# EasyEDA Pro project 显示30000字版电池内阻仪.eprj, board PCB2
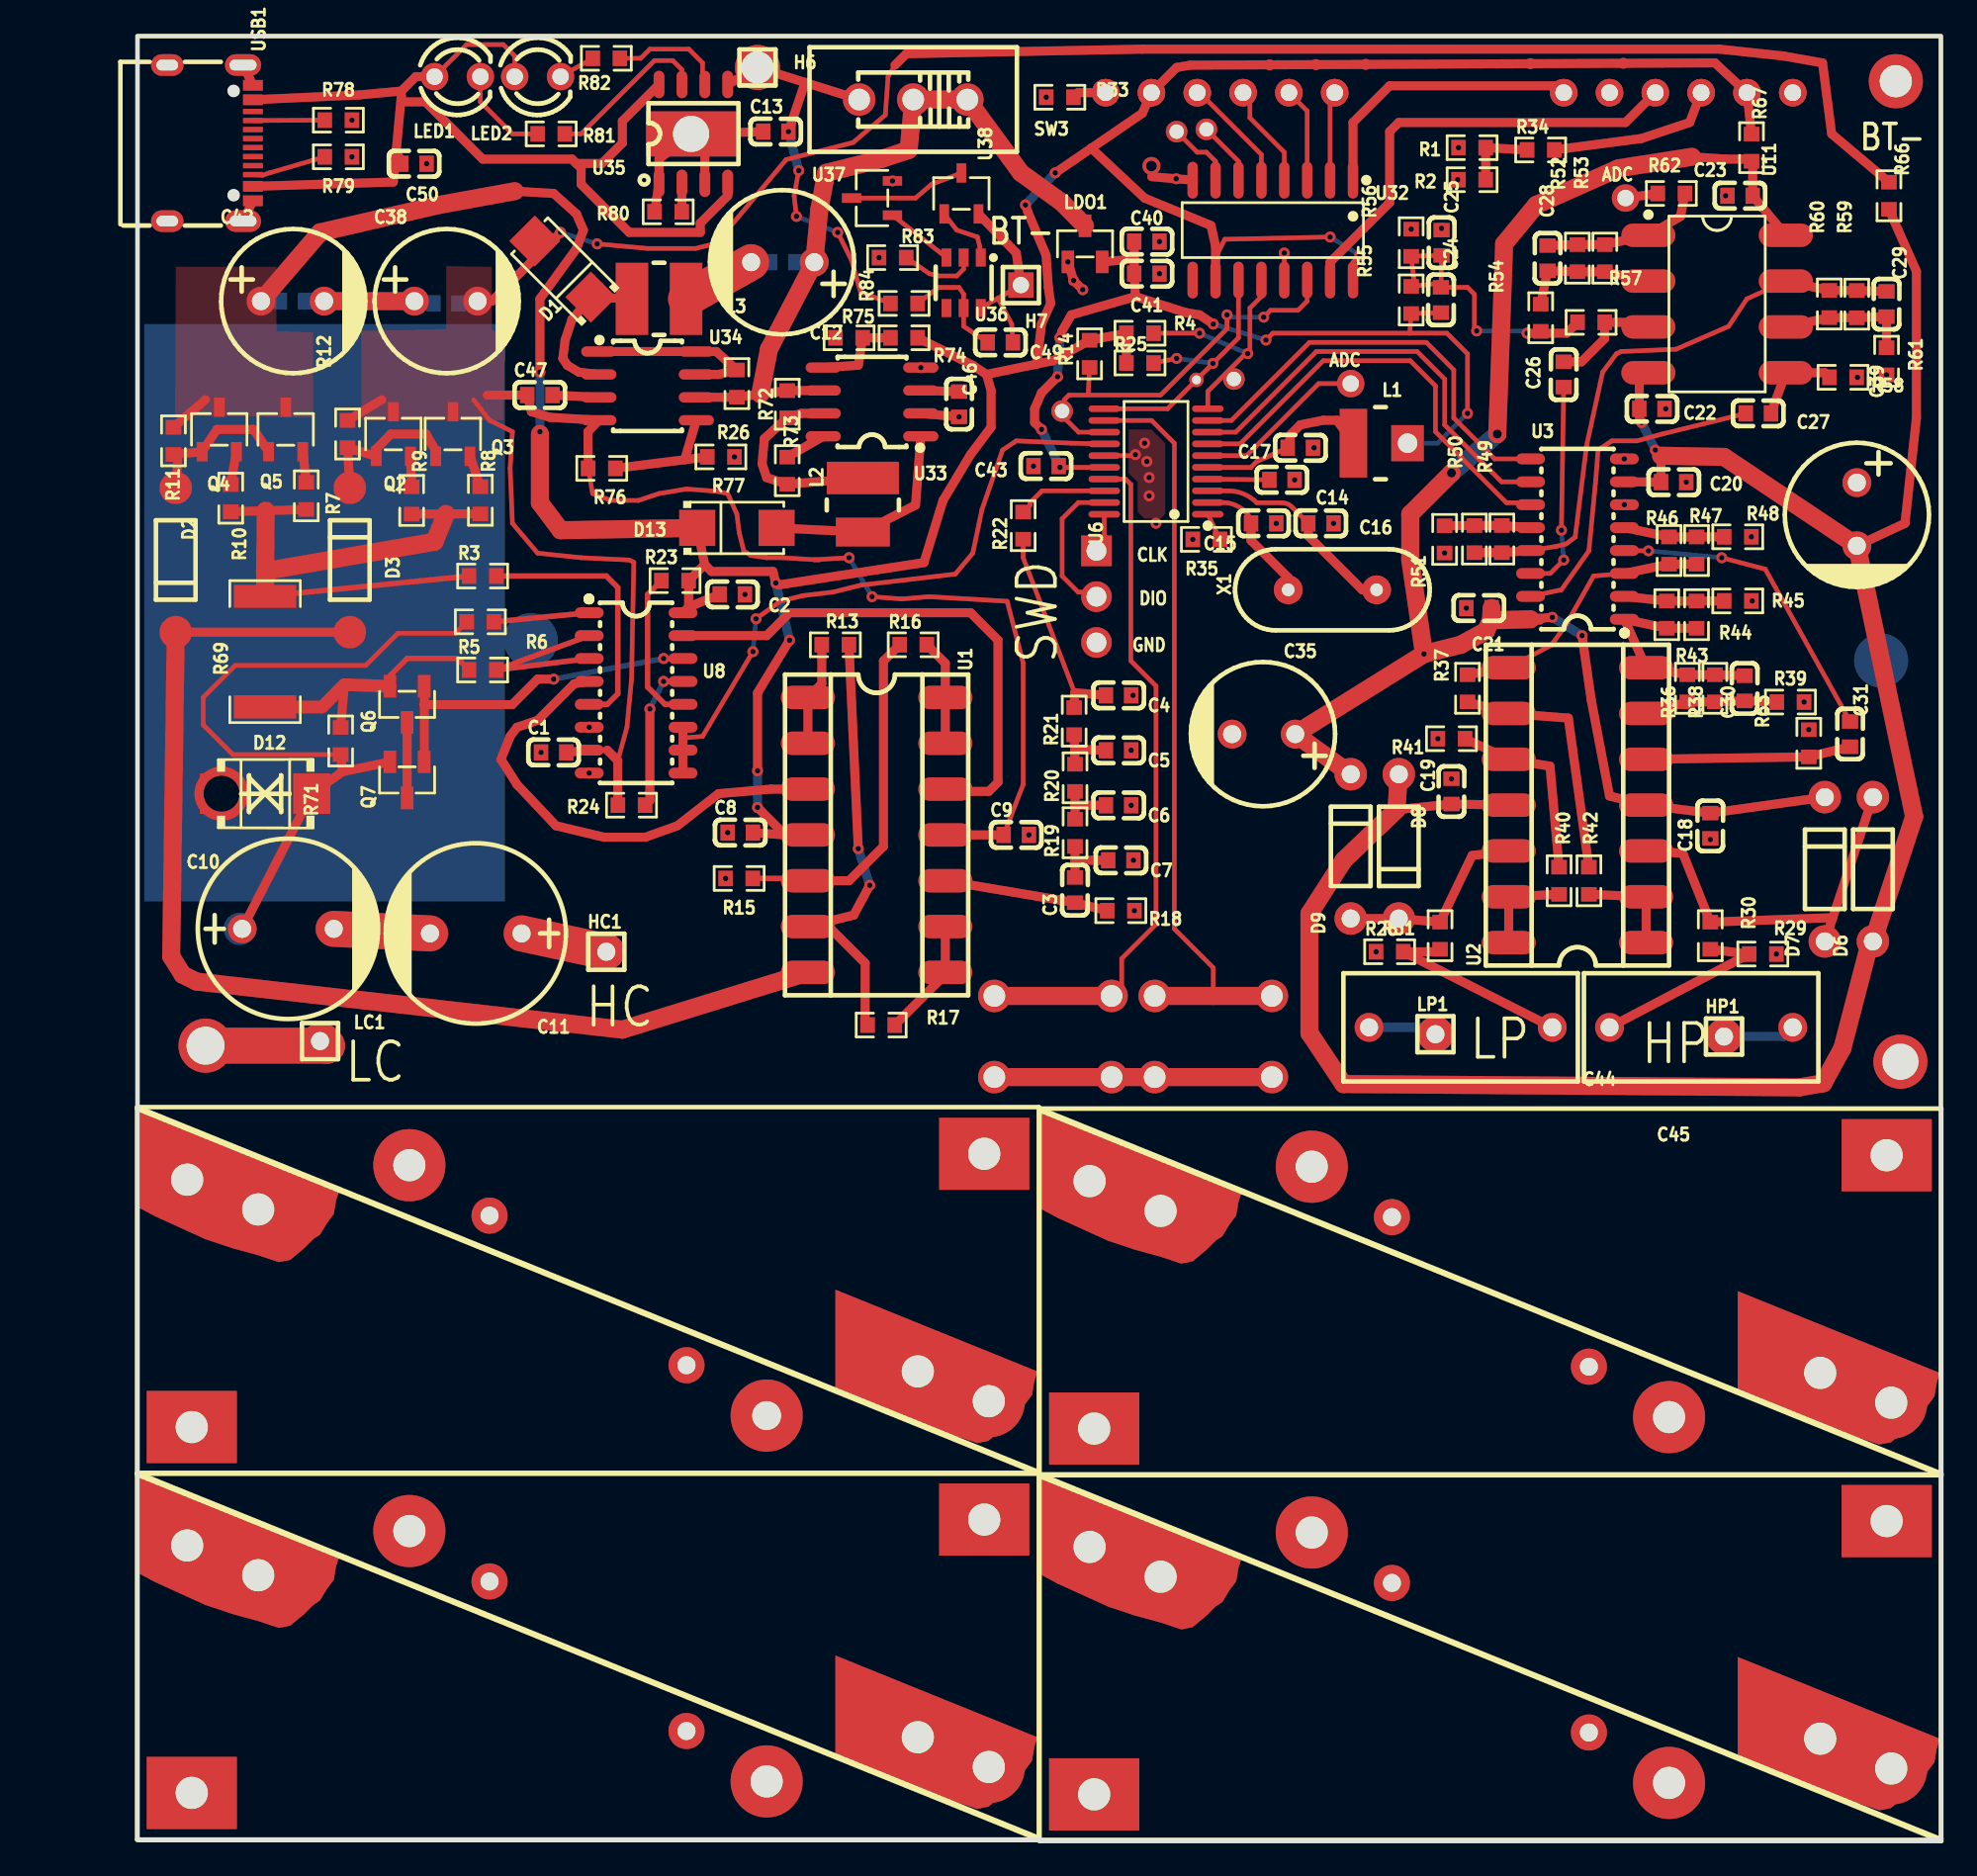
[diagram p1: board, top side]
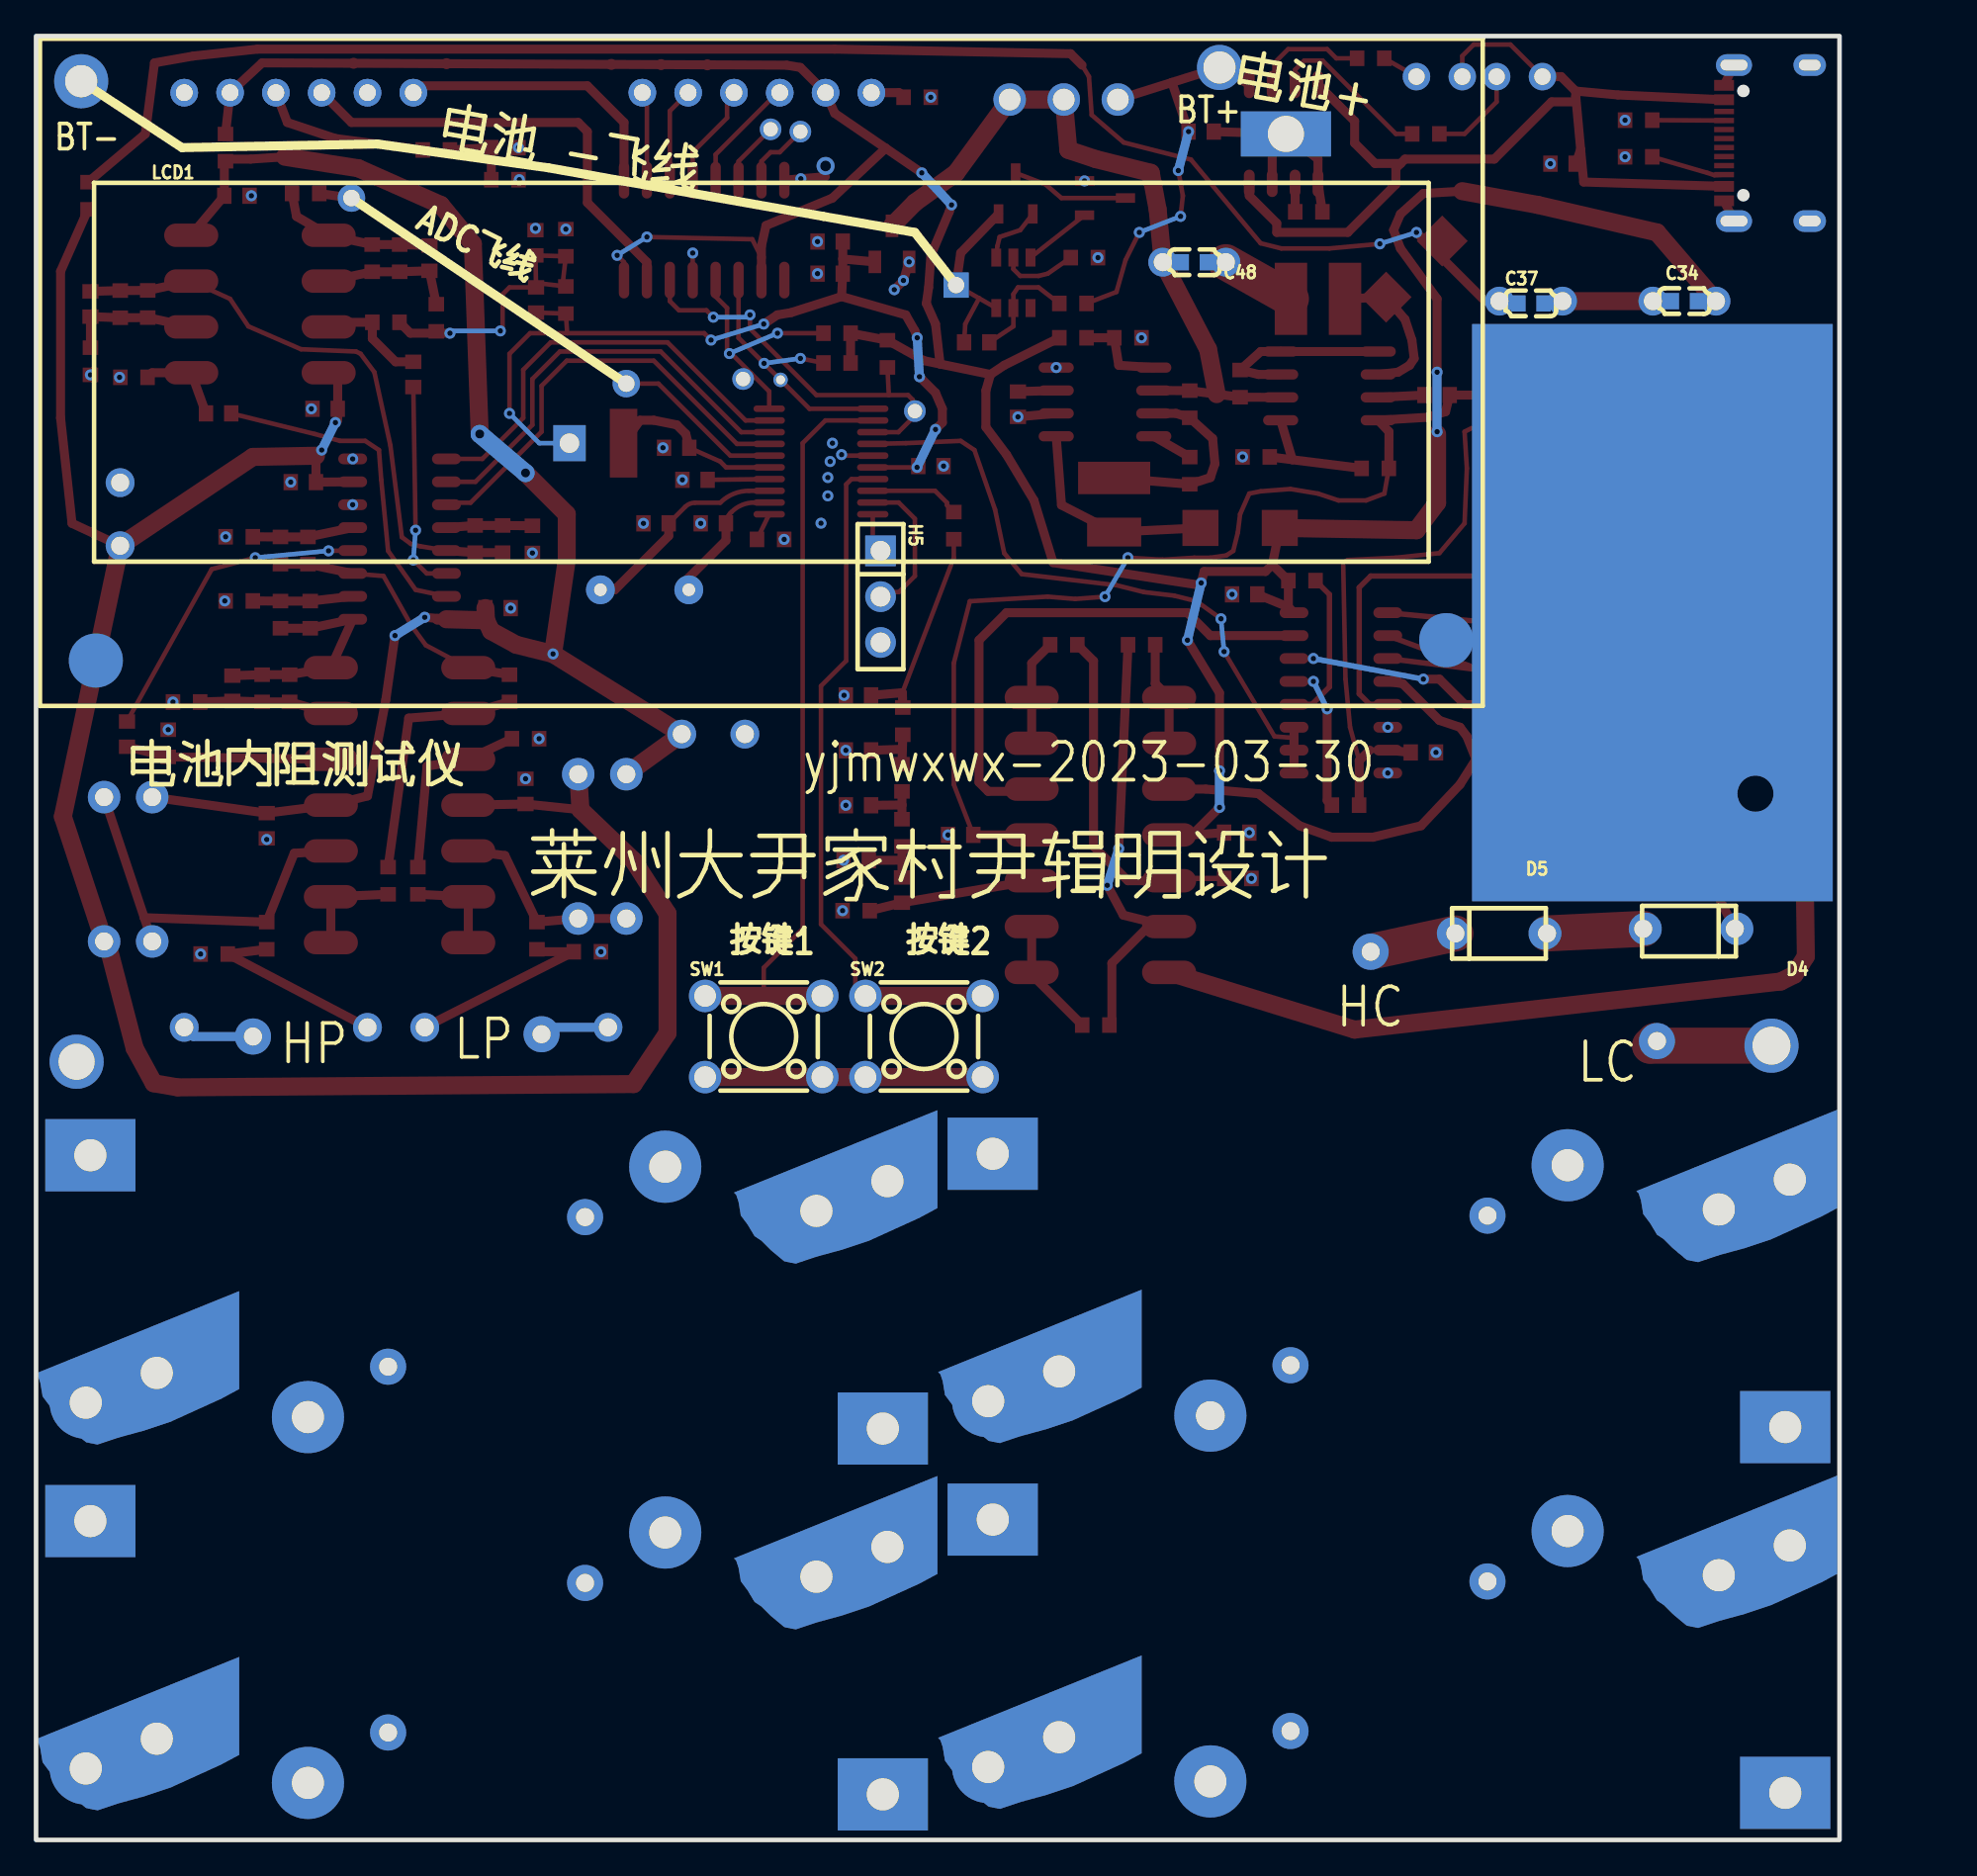
[diagram p2: board, bottom side, seen from below]

Outline 100 x 100 mm; copper layers: Top Layer, Bottom Layer. Coordinates in mm from the lower left corner of the outline.
Outline path: rectangle 0,100 100,0
Stack: Top Layer 0.035mm / Dielectric1 1.51mm FR4 er 4.5 / Bottom Layer 0.035mm

## Design rules (mm)
spacing safeClearance (default): track to track 0.152, other pairs 0.152 to 0.3
track width trackWidth (default): min 0.127, default 0.254, max 2.54
differential pair differentialPair (default): width min 0.127, default 0.254, max 2.54; gap min 0.152, default 0.152
via viaSize (default): diameter min 0.5, default 0.61, max 10; hole min 0.3, default 0.305, max 6

## Placement (name value [footprint] x y rotation side)
C1  100nF  [C0603]  23.08 60.29 0 top
C2  100nF  [C0603]  32.98 69.05 180 top
C3  10uF  [C0603]  51.99 52.66 90 top
C4  1nF  [C0603]  54.4 63.45 180 top
C5  1nF  [C0603]  54.4 60.41 180 top
C6  1nF  [C0603]  54.4 57.36 180 top
C7  100pF  [C0603]  54.53 54.31 180 top
C8  100nF  [C0603]  33.43 55.84 0 top
C9  100nF  [C0603]  48.73 55.72 0 top
C10  47uF  [CAP-TH_BD10.0-P5.00-D1.0-FD]  8.34 50.51 0 top
C11  47uF  [CAP-TH_BD10.0-P5.00-D1.0-FD]  18.76 50.25 180 top
C12  470uF  [CAP-TH_BD8.0-P3.50-D0.6-FD]  35.78 87.47 180 top
C13  10uF  [C0603]  35.4 94.7 0 top
C14  100nF  [C0603]  63.46 75.4 0 top
C15  20pF  [C0603]  62.45 72.99 0 top
C16  20pF  [C0603]  65.62 72.99 0 top
C17  10uF  [C0603]  64.48 77.18 180 top
C18  10uF  [C0603]  87.21 56.22 90 top
C19  10uF  [C0603]  72.86 58.13 90 top
C20  10uF  [C0603]  85.18 75.27 180 top
C21  10uF  [C0603]  74.38 68.29 0 top
C22  10uF  [C0603]  83.97 79.34 180 top
C23  10uF  [C0603]  88.86 91.15 0 top
C24  10uF  [C0603]  72.28 85.37 270 top
C25  10uF  [C0603]  72.31 88.54 270 top
C26  100nF  [C0603]  79.08 81.24 90 top
C27  100nF  [C0603]  89.88 79.08 0 top
C28  1nF  [C0603]  78.19 87.69 90 top
C29  1nF  [C0603]  96.98 85.15 90 top
C30  1nF  [C0603]  89.12 63.84 90 top
C31  100nF  [C0603]  94.96 61.3 270 top
C34  100nF  [C0603]  8.6 85.31 180 bottom
C35  470uF  [CAP-TH_BD8.0-P3.50-D0.6-FD]  62.45 61.3 180 top
C37  100nF  [C0603]  17.11 85.18 180 bottom
C38  470uF  [CAP-TH_BD8.0-P3.50-D0.6-FD]  17.11 85.31 0 top
C39  470uF  [CAP-TH_BD8.0-P3.50-D0.6-FD]  95.34 73.5 270 top
C40  100nF  [C0603]  55.97 88.61 180 top
C41  10uF  [C0603]  55.97 86.83 180 top
C42  470uF  [CAP-TH_BD8.0-P3.50-D0.6-FD]  8.6 85.31 0 top
C43  10uF  [C0603]  50.38 76.16 0 top
C44  100nF  [CAP-TH_L13.0-W6.0-P10.00-D1.0]  73.37 45.05 180 top
C45  100nF  [CAP-TH_L13.0-W6.0-P10.00-D1.0]  86.7 45.05 0 top
C46  1nF  [C0603]  45.56 79.59 270 top
C47  1nF  [C0603]  22.31 80.1 0 top
C48  100nF  [C0603]  35.78 87.47 0 bottom
C49  100nF  [C0603]  47.84 83.02 180 top
C50  10uF  [C0603]  15.33 92.93 180 top
D1  SS34  [SMA_L4.3-W2.6-LS5.2-RD]  23.58 87.08 135 top
D2  1N4148  [DO-35_BD2.0-L4.0-P8.00-D0.5-FD]  2.12 70.95 270 top
D3  1N4148  [DO-35_BD2.0-L4.0-P8.00-D0.5-FD]  11.77 70.95 90 top
D4  -  [DO_1N4007]  8.34 50.38 0 bottom
D5  -  [DO_1N4007#2]  18.89 50.25 180 bottom
D6  1N4148  [DO-35_BD2.0-L4.0-P8.00-D0.5-FD#2]  96.23 53.81 90 top
D7  1N4148  [DO-35_BD2.0-L4.0-P8.00-D0.5-FD#2]  93.56 53.81 90 top
D8  1N4148  [DO-35_BD2.0-L4.0-P8.00-D0.5-FD#2]  69.94 55.08 270 top
D9  1N4148  [DO-35_BD2.0-L4.0-P8.00-D0.5-FD#2]  67.27 55.08 90 top
D12  1.0SMBJ5.0CA  [SMB_L4.6-W3.6-LS5.3-BI]  7.07 58 0 top
D13  SS34  [SMA_L4.3-W2.6-LS5.2-RD]  33.24 72.73 0 top
H5  -  [HDR-TH_3P-P2.54-V-M]  53.18 68.92 270 bottom
H6  -  [HDR-TH_1P-V-M_XKB_X4611WV-01I-C28D40]  34.38 98.26 0 top
H7  -  [HDR-TH_1P-V-M_XKB_X4611WV-01I-C28D40#2]  48.98 86.19 0 top
HC1  -  [HDR-TH_1P-V-M_XKB_X4611WV-01I-C28D40#3]  26 49.24 0 top
HP1  -  [HDR-TH_1P-V-M_XKB_X4611WV-01I-C28D40#3]  87.97 44.54 0 top
L1  47uH  [IND-SMD_L4.5-W4.0_SLF0403]  68.92 77.43 0 top
L2  47uH  [IND-SMD_L4.5-W4.0_SLF0403#2]  40.22 74 270 top
L3  47uH  [IND-SMD_L4.5-W4.0_SLF0403#3]  28.92 85.43 180 top
LC1  -  [HDR-TH_1P-V-M_XKB_X4611WV-01I-C28D40#3]  10.12 44.28 0 top
LCD1  LCM1602K-FSW-FBW  [MODULE-TH_LCM1602K]  72.73 96.86 180 bottom
LDO1  SC662K-3.3V  [SOT-23-3_L2.9-W1.3-P1.90-LS2.4-BR]  52.54 88.48 270 top
LED1  -  [LED_TH-3mm]  17.74 97.75 0 top
LED2  -  [LED_TH-3mm]  22.19 97.75 0 top
LP1  -  [HDR-TH_1P-V-M_XKB_X4611WV-01I-C28D40#3]  71.97 44.67 0 top
NOREF  -  [Pad_e749]  89.24 96.86 0 top
NOREF#2  -  [Pad_e1699]  82.39 98.49 0 top
NOREF#3  -  [Pad_e561]  84.93 23.44 180 top
NOREF#4  -  [Pad_e569]  96.99 37.96 0 top
NOREF#5  -  [Pad_e726]  53.68 96.86 0 top
NOREF#6  -  [Pad_e1668]  62.78 98.41 0 top
NOREF#7  -  [Pad_e585]  30.44 26.32 20 top
NOREF#8  -  [Pad_e576]  69.56 14.25 200 top
NOREF#9  -  [Pad_e736]  63.84 96.86 0 top
NOREF#10  -  [Pad_e584]  34.89 23.52 180 top
NOREF#11  -  [Pad_e607]  19.52 14.33 200 top
NOREF#12  -  [Pad_e580]  93.31 5.61 160 top
NOREF#13  -  [Pad_e1691]  77.24 98.47 0 top
NOREF#14  -  [Pad_e1327]  21.81 66.51 0 top
NOREF#15  -  [Pad_e611]  47.21 4.04 160 top
NOREF#16  -  [Pad_e599]  52.79 36.52 340 top
NOREF#17  -  [Pad_e560]  97.24 24.24 160 top
NOREF#18  -  [Pad_e742]  79.08 96.86 0 top
NOREF#19  -  [Pad_e588]  15.08 37.4 0 top
NOREF#20  -  [Pad_e728]  56.22 96.86 0 top
NOREF#21  -  [Pad_e590]  19.52 34.61 200 top
NOREF#22  -  [Pad_e1334]  10.38 68.03 90 top
NOREF#23  -  [Pad_e586]  43.27 25.97 160 top
NOREF#24  -  [Pad_e854]  57.62 94.7 0 top
NOREF#25  -  [Pad_e1447]  82.51 91.02 0 top
NOREF#26  -  [Pad_e562]  80.48 26.23 20 top
NOREF#27  -  [Pad_e606]  30.44 6.04 20 top
NOREF#28  -  [Pad_e615]  2.76 16.32 340 top
NOREF#29  -  [Pad_e1]  3.77 44.03 0 top
NOREF#30  -  [Pad_e593]  3.01 22.89 180 top
NOREF#31  -  [Pad_e609]  15.08 17.12 0 top
NOREF#32  -  [Pad_e596]  47.21 24.32 160 top
NOREF#33  -  [Pad_e1675]  65.34 98.42 0 top
NOREF#34  -  [Pad_e610]  46.95 17.76 0 top
NOREF#35  -  [Pad_e587]  44.34 25.45 180 top
NOREF#36  -  [Pad_e604]  53.05 2.53 180 top
NOREF#37  -  [Pad_e750]  91.78 96.86 0 top
NOREF#38  -  [Pad_e1653]  60.79 80.99 0 top
NOREF#39  -  [Pad_e594]  52.79 16.24 340 top
NOREF#40  -  [Pad_e564]  69.56 34.53 200 top
NOREF#41  -  [Pad_e597]  46.95 38.04 0 top
NOREF#42  -  [Pad_e582]  55.66 15.12 0 top
NOREF#43  -  [Pad_e1654]  58.72 80.94 0 top
NOREF#44  -  [Pad_e589]  6.69 34.95 340 top
NOREF#45  -  [Pad_e741]  66.38 96.86 0 top
NOREF#46  -  [Pad_e365]  97.5 97.5 0 top
NOREF#47  -  [Pad_e598]  55.66 35.4 0 top
NOREF#48  -  [Pad_e583]  56.73 14.59 340 top
NOREF#49  -  [Pad_e732]  61.3 96.86 0 top
NOREF#50  -  [Pad_e572]  94.38 5.09 180 top
NOREF#51  -  [Pad_e579]  96.99 17.68 0 top
NOREF#52  -  [Pad_e746]  84.16 96.86 0 top
NOREF#53  -  [Pad_e559]  94.38 25.37 180 top
NOREF#54  -  [Pad_e855]  59.27 94.83 0 top
NOREF#55  -  [Pad_e601]  5.62 15.2 0 top
NOREF#56  -  [Pad_e566]  93.31 25.89 160 top
NOREF#57  -  [Pad_e748]  86.7 96.86 0 top
NOREF#58  -  [Pad_e616]  6.69 14.67 340 top
NOREF#59  -  [Pad_e909]  30.7 94.58 90 top
NOREF#60  -  [Pad_e624]  67.27 80.73 0 top
NOREF#61  -  [Pad_e574]  84.93 3.16 180 top
NOREF#62  -  [Pad_e578]  65.11 17.04 0 top
NOREF#63  -  [Pad_e573]  97.24 3.96 160 top
NOREF#64  -  [Pad_e575]  80.48 5.96 20 top
NOREF#65  -  [Pad_e592]  2.76 36.6 340 top
NOREF#66  -  [Pad_e557]  5.62 35.48 0 top
NOREF#67  -  [Pad_e613]  44.34 5.17 180 top
NOREF#68  -  [Pad_e595]  53.05 22.81 180 top
NOREF#69  -  [Pad_e1684]  68.1 98.43 0 top
NOREF#70  -  [Pad_e1651]  51.27 79.21 0 top
NOREF#71  -  [Pad_e600]  56.73 34.87 340 top
NOREF#72  -  [Pad_e744]  81.62 96.86 0 top
NOREF#73  -  [Pad_e617]  3.01 2.61 180 top
NOREF#74  -  [Pad_e605]  34.89 3.24 180 top
NOREF#75  -  [Pad_e730]  58.76 96.86 0 top
NOREF#76  -  [Pad_e568]  65.11 37.32 0 top
NOREF#77  -  [Pad_e612]  43.27 5.69 160 top
NOREF#78  -  [Pad_e2]  97.75 43.14 0 top
NOREF#79  -  [Pad_e1329]  96.68 65.38 0 top
Q2  SS8550  [SOT-23-3_L2.9-W1.6-P1.90-LS2.8-BR]  14.19 77.94 270 top
Q3  SS8550  [SOT-23-3_L2.9-W1.6-P1.90-LS2.8-BR]  17.49 77.94 270 top
Q4  SS8050  [SOT-23-3_L2.9-W1.6-P1.90-LS2.8-BR]  4.53 78.19 270 top
Q5  SS8050  [SOT-23-3_L2.9-W1.6-P1.90-LS2.8-BR]  8.22 78.19 270 top
Q6  AO3400A  [SOT-23-3_L2.9-W1.3-P1.90-LS2.4-BR]  14.95 62.95 90 top
Q7  AO3400A  [SOT-23-3_L2.9-W1.3-P1.90-LS2.4-BR]  14.95 58.76 90 top
R1  1K  [R0603]  74 93.81 0 top
R2  1K  [R0603]  74 92.04 0 top
R3  100  [R0603]  19.14 70.07 0 top
R4  500  [R0603]  55.59 83.53 180 top
R5  100  [R0603]  19.14 64.86 0 top
R6  100  [R0603]  19.01 67.53 0 top
R7  1  [R0603]  9.36 74.51 90 top
R8  1  [R0603]  19.01 74.27 270 top
R9  1  [R0603]  15.2 74.26 270 top
R10  1  [R0603]  5.17 74.38 90 top
R11  5K  [R0603]  1.99 77.56 90 top
R12  5K  [R0603]  11.65 77.94 270 top
R13  10K  [R0603]  38.7 66.26 180 top
R14  500  [R0603]  52.79 82.39 90 top
R15  10K  [R0603]  33.36 53.3 0 top
R16  10K  [R0603]  43.01 66.26 0 top
R17  10K  [R0603]  41.24 45.17 180 top
R18  1M  [R0603]  54.53 51.52 180 top
R19  10K  [R0603]  51.99 55.83 90 top
R20  10K  [R0603]  51.99 58.88 90 top
R21  10K  [R0603]  51.94 62.02 90 top
R22  10K  [R0603]  49.11 72.86 90 top
R23  1K  [R0603]  29.81 69.81 180 top
R24  1K  [R0603]  27.39 57.37 0 top
R25  500  [R0603]  55.59 81.88 180 top
R26  0.5  [R0603]  33.24 80.73 270 top
R28  1M  [R0603]  69.43 49.24 0 top
R29  1M  [R0603]  90.12 49.11 180 top
R30  1K  [R0603]  87.21 50.13 90 top
R31  1K  [R0603]  72.22 50.13 90 top
R33  1K  [R0603]  51.14 96.61 180 top
R34  1K  [R0603]  77.8 93.69 0 top
R35  10K  [R0603]  59.27 72.1 180 top
R36  10K  [R0603]  85.94 63.84 270 top
R37  10K  [R0603]  73.75 63.84 90 top
R38  100K  [R0603]  87.47 63.84 90 top
R39  1K  [R0603]  91.66 63.08 180 top
R40  10K  [R0603]  78.83 53.17 270 top
R41  10K  [R0603]  72.86 61.05 0 top
R42  10K  [R0603]  80.48 53.17 90 top
R43  1K  [R0603]  84.8 67.92 270 top
R44  10K  [R0603]  86.45 67.92 270 top
R45  100  [R0603]  88.74 68.69 180 top
R46  1K  [R0603]  84.93 71.48 270 top
R47  10K  [R0603]  86.45 71.48 270 top
R48  100  [R0603]  88.74 72.24 180 top
R49  1K  [R0603]  74.13 72.11 270 top
R50  10K  [R0603]  75.65 72.11 270 top
R51  100  [R0603]  72.48 72.1 90 top
R52  10K  [R0603]  79.84 87.69 90 top
R53  100K  [R0603]  81.36 87.69 270 top
R54  1K  [R0603]  77.81 84.39 270 top
R55  1K  [R0603]  70.62 85.37 270 top
R56  1K  [R0603]  70.62 88.54 270 top
R57  10K  [R0603]  80.6 84.13 180 top
R58  10K  [R0603]  94.57 81.08 180 top
R59  10K  [R0603]  95.33 85.14 90 top
R60  100K  [R0603]  93.81 85.15 270 top
R61  1K  [R0603]  96.98 81.97 90 top
R62  100  [R0603]  85.05 91.28 180 top
R63  10K  [R0603]  92.67 60.8 270 top
R66  10  [R0603]  97.12 91.15 270 top
R67  10  [R0603]  89.5 93.81 270 top
R69  25Ω  [R2512]  7.07 65.88 90 top
R71  250  [R0603]  11.27 60.92 90 top
R72  0.5  [R0603]  36.03 79.59 90 top
R73  100  [R0603]  36.03 75.91 270 top
R74  10K  [R0603]  42.51 83.27 0 top
R75  3.33K  [R0603]  39.46 83.27 0 top
R76  3.33K  [R0603]  25.74 76.03 180 top
R77  10K  [R0603]  32.35 76.67 180 top
R78  10K  [R0603]  11.14 95.34 180 top
R79  10K  [R0603]  11.14 93.31 180 top
R80  1.3K  [R0603]  29.43 90.26 0 top
R81  1K  [R0603]  22.94 94.58 180 top
R82  1K  [R0603]  26 98.77 180 top
R83  1K  [R0603]  41.87 87.72 180 top
R84  100K  [R0603]  42.51 85.18 0 top
SW1  1TS005A-2600-5001  [SW-TH_4P-L6.0-W6.0-P4.50-LS6.5]  59.65 44.54 180 bottom
SW2  1TS005A-2600-5001  [SW-TH_4P-L6.0-W6.0-P4.50-LS6.5]  50.76 44.54 180 bottom
SW3  SS-12F20-G070  [SW-TH_G-SWITCH_SS-12F20-G070]  43.01 96.48 0 top
U1  TL084CN  [DIP-14_L17.8-W10.2-P2.54-BL]  40.98 55.72 270 top
U2  TL084CN  [DIP-14_L17.8-W10.2-P2.54-BL]  79.84 57.37 90 top
U3  CD4053BM/TR  [SOP-16_L9.9-W3.9-P1.27-LS6.1-BL]  79.84 72.11 90 top
U6  STM32F030F4P6  [TSSOP-20_L6.5-W4.4-P0.65-LS6.4-BL]  56.48 76.42 90 top
U8  CD4053BM/TR  [SOP-16_L9.9-W3.9-P1.27-LS6.1-BL]  27.65 63.59 270 top
U11  NE5532P  [DIP-8_L9.4-W6.4-P2.54-LS9.1-BL]  87.59 85.15 270 top
U32  74HC595D.  [SOP-16_L9.9-W3.9-P1.27-LS6.0-BL]  62.95 89.24 180 top
U33  MC34063  [SOIC-8_L5.0-W4.0-P1.27-LS6.0-BL]  40.73 79.72 90 top
U34  MC34063  [SOIC-8_L5.0-W4.0-P1.27-LS6.0-BL]  28.28 80.61 270 top
U35  WSP4056  [SOP-8_L5.1-W3.9-P1.27-LS6.0-BL]  30.82 94.58 0 top
U36  WSTDW01  [SOT-23-6_L2.9-W1.6-P0.95-LS2.8-BR]  45.81 86.32 90 top
U37  AO3400A  [SOT-23-3_L3.0-W1.6-P1.90-LS2.8-BR]  40.73 91.02 0 top
U38  AO3400A  [SOT-23-3_L3.0-W1.6-P1.90-LS2.8-BR]  45.68 91.28 270 top
USB1  TYPE-C 16PIN 2MD(073)  [USB-C-SMD_TYPE-C-6PIN-2MD-073]  4.03 94.07 270 top
X1  8MHz  [OSC-TH_L10.0-W4.5-P5.00]  66.26 69.3 90 top

## Footprints (pads in the part's own frame, mm; a bottom-side part is the same pattern mirrored in y, then rotated)
C0603
  rect 0.8x0.9 smd: 1(-0.7,0) 2(0.7,0)
CAP-TH_BD8.0-P3.50-D0.6-FD
  round 1.6 hole 1: 1(-1.75,0) 2(1.75,0)
CAP-TH_BD10.0-P5.00-D1.0-FD
  round 1.6 hole 1: 1(-2.54,0) 2(2.54,0)
CAP-TH_L13.0-W6.0-P10.00-D1.0
  round 1.6 hole 1: 1(-5.08,0) 2(5.08,0)
DIP-8_L9.4-W6.4-P2.54-LS9.1-BL
  oval 1.3x3 smd: 1(-3.81,-3.81) 2(-1.27,-3.81) 3(1.27,-3.81) 4(3.81,-3.81) 5(3.81,3.81) 6(1.27,3.81) 7(-1.27,3.81) 8(-3.81,3.81)
DIP-14_L17.8-W10.2-P2.54-BL
  oval 1.3x3 smd: 1(-7.62,-3.81) 2(-5.08,-3.81) 3(-2.54,-3.81) 4(0,-3.81) 5(2.54,-3.81) 6(5.08,-3.81) 7(7.62,-3.81) 8(7.62,3.81) 9(5.08,3.81) 10(2.54,3.81) 11(0,3.81) 12(-2.54,3.81) 13(-5.08,3.81) 14(-7.62,3.81)
DO-35_BD2.0-L4.0-P8.00-D0.5-FD
  round 1.8 smd: 1(-4,0) 2(4,0)
DO-35_BD2.0-L4.0-P8.00-D0.5-FD#2
  round 1.8 hole 1: 1(-4,0) 2(4,0)
DO_1N4007
  round 1.8 smd: 1(-2.667,-0.127) 2(2.413,-0.127)
DO_1N4007#2
  round 1.8 smd: 1(-2.54,0) 2(2.54,0)
HDR-TH_1P-V-M_XKB_X4611WV-01I-C28D40
  round 2.5 hole 1.78: 1(0,0)
HDR-TH_1P-V-M_XKB_X4611WV-01I-C28D40#2
  rect 1.4x1.4 hole 0.9: 1(0,0)
HDR-TH_1P-V-M_XKB_X4611WV-01I-C28D40#3
  round 2 hole 1: 1(0,0)
HDR-TH_3P-P2.54-V-M
  rect 1.7x1.7 hole 1.1: 1(-2.54,0)
  round 1.7 hole 1.1: 2(0,0) 3(2.54,0)
IND-SMD_L4.5-W4.0_SLF0403
  rect 1.524x3.81 smd: 1(-1.5,0)
  rect 1.8x2 hole 1.08: 2(1.5,0)
IND-SMD_L4.5-W4.0_SLF0403#2
  rect 1.8x4 smd: 1(-1.5,0)
  rect 1.6x3 smd: 2(1.5,0)
IND-SMD_L4.5-W4.0_SLF0403#3
  rect 1.8x4 smd: 1(-1.5,0) 2(1.5,0)
LED_TH-3mm
  round 1.524 hole 0.914: 1(-1.27,0) 2(1.27,0)
MODULE-TH_LCM1602K
  round 1.524 hole 0.914: 1(-19.05,0) 2(-16.51,0) 3(-13.97,0) 4(-11.43,0) 5(-8.89,0) 6(-6.35,0) 11(6.35,0) 12(8.89,0) 13(11.43,0) 14(13.97,0) 15(16.51,0) 16(19.05,0)
OSC-TH_L10.0-W4.5-P5.00
  round 1.6 hole 0.7: 1(0,2.45) 2(0,-2.45)
Pad_e1
  round 3 hole 2.1: 1(0,0)
Pad_e2
  round 3 hole 2: 1(0,0)
Pad_e365
  round 3 hole 1.78: 1(0,0)
Pad_e557
  custom 11.284x8.504 hole 0.005: 1(0,0)
Pad_e559
  custom 11.284x8.504 hole 0.005: 1(0,0)
Pad_e560
  oval 4x4 hole 1.78: 1(0,0)
Pad_e561
  round 4 hole 1.78: 1(0,0)
Pad_e562
  round 2 hole 1: 1(0,0)
Pad_e564
  round 2 hole 1: 1(0,0)
Pad_e566
  oval 4x4 hole 1.78: 1(0,0)
Pad_e568
  round 4 hole 1.78: 1(0,0)
Pad_e569
  rect 5x4 hole 1.78: 1(0,0)
Pad_e572
  custom 11.284x8.504 hole 0.005: 1(0,0)
Pad_e573
  oval 4x4 hole 1.78: 1(0,0)
Pad_e574
  round 4 hole 1.78: 1(0,0)
Pad_e575
  round 2 hole 1: 1(0,0)
Pad_e576
  round 2 hole 1: 1(0,0)
Pad_e578
  round 4 hole 1.78: 1(0,0)
Pad_e579
  rect 5x4 hole 1.78: 1(0,0)
Pad_e580
  oval 4x4 hole 1.78: 1(0,0)
Pad_e582
  custom 11.284x8.504 hole 0.005: 1(0,0)
Pad_e583
  oval 4x4 hole 1.78: 1(0,0)
Pad_e584
  round 4 hole 1.6: 1(0,0)
Pad_e585
  round 2 hole 1: 1(0,0)
Pad_e586
  oval 4x4 hole 1.78: 1(0,0)
Pad_e587
  custom 11.284x8.504 hole 0.005: 1(0,0)
Pad_e588
  round 4 hole 1.78: 1(0,0)
Pad_e589
  oval 4x4 hole 1.78: 1(0,0)
Pad_e590
  round 2 hole 1: 1(0,0)
Pad_e592
  oval 4x4 hole 1.78: 1(0,0)
Pad_e593
  rect 5x4 hole 1.78: 1(0,0)
Pad_e594
  oval 4x4 hole 1.78: 1(0,0)
Pad_e595
  rect 5x4 hole 1.78: 1(0,0)
Pad_e596
  oval 4x4 hole 1.78: 1(0,0)
Pad_e597
  rect 5x4 hole 1.78: 1(0,0)
Pad_e598
  custom 11.284x8.504 hole 0.005: 1(0,0)
Pad_e599
  oval 4x4 hole 1.78: 1(0,0)
Pad_e600
  oval 4x4 hole 1.78: 1(0,0)
Pad_e601
  custom 11.284x8.504 hole 0.005: 1(0,0)
Pad_e604
  rect 5x4 hole 1.78: 1(0,0)
Pad_e605
  round 4 hole 1.78: 1(0,0)
Pad_e606
  round 2 hole 1: 1(0,0)
Pad_e607
  round 2 hole 1: 1(0,0)
Pad_e609
  round 4 hole 1.78: 1(0,0)
Pad_e610
  rect 5x4 hole 1.78: 1(0,0)
Pad_e611
  oval 4x4 hole 1.78: 1(0,0)
Pad_e612
  oval 4x4 hole 1.78: 1(0,0)
Pad_e613
  custom 11.284x8.504 hole 0.005: 1(0,0)
Pad_e615
  oval 4x4 hole 1.78: 1(0,0)
Pad_e616
  oval 4x4 hole 1.78: 1(0,0)
Pad_e617
  rect 5x4 hole 1.78: 1(0,0)
Pad_e624
  round 1.524 hole 0.914: 1(0,0)
Pad_e726
  round 1.524 hole 0.914: 2(0,0)
Pad_e728
  round 1.524 hole 0.914: 3(0,0)
Pad_e730
  round 1.524 hole 0.914: 4(0,0)
Pad_e732
  round 1.524 hole 0.914: 5(0,0)
Pad_e736
  round 1.524 hole 0.914: 6(0,0)
Pad_e741
  round 1.524 hole 0.914: 7(0,0)
Pad_e742
  round 1.524 hole 0.914: 8(0,0)
Pad_e744
  round 1.524 hole 0.914: 9(0,0)
Pad_e746
  round 1.524 hole 0.914: 10(0,0)
Pad_e748
  round 1.524 hole 0.914: 11(0,0)
Pad_e749
  round 1.524 hole 0.914: 12(0,0)
Pad_e750
  round 1.524 hole 0.914: 13(0,0)
Pad_e854
  round 1.2 hole 0.8: 1(0,0)
Pad_e855
  round 1.2 hole 0.8: 14(0,0)
Pad_e909
  rect 2.5x5 hole 2: 1(0,0)
Pad_e1327
  round 3 smd far side: TP3(0,0)
Pad_e1329
  round 3 smd far side: TP5(0,0)
Pad_e1334
  rect 32x20 smd far side: 2(0,0)
Pad_e1447
  round 1.524 hole 0.914: 1(0,0)
Pad_e1651
  round 1.2 hole 0.8: 1(0,0)
Pad_e1653
  round 1.2 hole 0.8: 15(0,0)
Pad_e1654
  round 0.8 hole 0.5: 16(0,0)
Pad_e1668
  round 0.61 smd: TP1(0,0)
Pad_e1675
  round 0.61 smd: TP2(0,0)
Pad_e1684
  round 0.61 smd: TP3(0,0)
Pad_e1691
  round 0.61 smd: TP4(0,0)
Pad_e1699
  round 0.61 smd: TP5(0,0)
R0603
  rect 0.806x0.864 smd: 1(-0.753,0) 2(0.753,0)
R2512
  rect 1.282x3.456 smd: 1(-3.067,0) 2(3.067,0)
SMA_L4.3-W2.6-LS5.2-RD
  rect 2x2 smd: 1(-2.2,0) 2(2.2,0)
SMB_L4.6-W3.6-LS5.3-BI
  rect 2.047x2.241 smd: 1(-2.591,0) 2(2.591,0)
SOIC-8_L5.0-W4.0-P1.27-LS6.0-BL
  oval 0.569x1.95 smd: 1(-1.905,-2.705) 2(-0.635,-2.705) 3(0.635,-2.705) 4(1.905,-2.705) 5(1.905,2.705) 6(0.635,2.705) 7(-0.635,2.705) 8(-1.905,2.705)
SOP-8_L5.1-W3.9-P1.27-LS6.0-BL
  oval 0.6x1.52 smd: 1(-1.905,-2.74) 2(-0.635,-2.74) 3(0.635,-2.74) 4(1.905,-2.74) 5(1.905,2.74) 6(0.635,2.74) 7(-0.635,2.74) 8(-1.905,2.74)
SOP-16_L9.9-W3.9-P1.27-LS6.0-BL
  oval 0.574x2.038 smd: 1(-4.445,-2.769) 2(-3.175,-2.769) 3(-1.905,-2.769) 4(-0.635,-2.769) 5(0.635,-2.769) 6(1.905,-2.769) 7(3.175,-2.769) 8(4.445,-2.769) 9(4.445,2.769) 10(3.175,2.769) 11(1.905,2.769) 12(0.635,2.769) 13(-0.635,2.769) 14(-1.905,2.769) 15(-3.175,2.769) 16(-4.445,2.769)
SOP-16_L9.9-W3.9-P1.27-LS6.1-BL
  oval 0.6x1.6 smd: 1(-4.445,-2.6) 2(-3.175,-2.6) 3(-1.905,-2.6) 4(-0.635,-2.6) 5(0.635,-2.6) 6(1.905,-2.6) 7(3.175,-2.6) 8(4.445,-2.6) 9(4.445,2.6) 10(3.175,2.6) 11(1.905,2.6) 12(0.635,2.6) 13(-0.635,2.6) 14(-1.905,2.6) 15(-3.175,2.6) 16(-4.445,2.6)
SOT-23-3_L2.9-W1.3-P1.90-LS2.4-BR
  rect 1.25x0.7 smd: 1(1,-0.95) 2(1,0.95) 3(-1,0)
SOT-23-3_L2.9-W1.6-P1.90-LS2.8-BR
  rect 1.07x0.6 smd: 1(1.235,-0.95) 2(1.235,0.95) 3(-1.235,0)
SOT-23-3_L3.0-W1.6-P1.90-LS2.8-BR
  rect 1.07x0.532 smd: 1(1.135,-0.95) 2(1.135,0.95) 3(-1.135,0)
SOT-23-6_L2.9-W1.6-P0.95-LS2.8-BR
  rect 1x0.55 smd: 1(1.4,-0.95) 2(1.4,0) 3(1.4,0.95) 4(-1.4,0.95) 5(-1.4,0) 6(-1.4,-0.95)
SW-TH_4P-L6.0-W6.0-P4.50-LS6.5
  round 1.8 hole 1.2: 1(-3.25,2.25) 2(3.25,2.25) 3(-3.25,-2.25) 4(3.25,-2.25)
SW-TH_G-SWITCH_SS-12F20-G070
  round 1.8 hole 1.2: 1(-3,0) 2(0,0) 3(3,0)
TSSOP-20_L6.5-W4.4-P0.65-LS6.4-BL
  oval 0.364x1.742 smd: 1(-2.925,-2.871) 2(-2.275,-2.871) 3(-1.625,-2.871) 4(-0.975,-2.871) 5(-0.325,-2.871) 6(0.325,-2.871) 7(0.975,-2.871) 8(1.625,-2.871) 9(2.275,-2.871) 10(2.925,-2.871) 11(2.925,2.871) 12(2.275,2.871) 13(1.625,2.871) 14(0.975,2.871) 15(0.325,2.871) 16(-0.325,2.871) 17(-0.975,2.871) 18(-1.625,2.871) 19(-2.275,2.871) 20(-2.925,2.871)
USB-C-SMD_TYPE-C-6PIN-2MD-073
  rect 0.6x1.1 smd: 1(-3.2,2.375) 2(-2.4,2.375) 11(2.4,2.375) 12(3.2,2.375)
  rect 0.3x1.1 smd: 3(-1.75,2.375) 4(-1.25,2.375) 5(-0.75,2.375) 6(-0.25,2.375) 7(0.25,2.375) 8(0.75,2.375) 9(1.25,2.375) 10(1.75,2.375)
  oval 1.2x2 hole 0.6x1.5: 13(-4.325,1.825) 14(4.325,1.825)
  oval 1.2x1.8 hole 0.6x1.2: 13(-4.325,-2.375) 14(4.325,-2.375)

## Nets
As in the schematic, except:
+5V-D: C2.2 C8.2 C34.2 C42.1 D13.1 LCD1.2 LCD1.15 NOREF.12 NOREF#2.TP5 NOREF#6.TP1 NOREF#13.TP4 NOREF#20.3 NOREF#33.TP2 NOREF#69.TP3 Q4.3 Q5.3 R4.2 R11.2 R14.2 R23.1 R25.2 R67.1 R74.2 U1.4 U8.16 U32.10 U32.16
-5V-D: C1.2 C9.1 C37.1 C38.2 C47.1 D1.2 Q2.3 Q3.3 R12.1 R24.1 R66.1 R76.2 U1.11 U8.7 U34.4
GND: C1.1 C2.1 C4.1 C5.1 C6.1 C7.1 C8.1 C9.2 C12.2 C13.1 C14.2 C15.2 C16.2 C17.1 C18.1 C19.2 C20.1 C21.1 C22.1 C23.1 C25.1 C34.1 C35.2 C37.2 C38.1 C39.1 C40.1 C41.1 C42.2 C43.1 C46.2 C48.1 C50.1 D12.1 H5.3 L3.1 LC1.1 LCD1.1 LCD1.5 LDO1.1 NOREF#3.1 NOREF#4.1 NOREF#7.1 NOREF#8.1 NOREF#10.1 NOREF#11.1 NOREF#14.TP3 NOREF#19.1 NOREF#21.1 NOREF#22.2 NOREF#26.1 NOREF#27.1 NOREF#29.1 NOREF#30.1 NOREF#31.1 NOREF#34.1 NOREF#36.1 NOREF#37.13 NOREF#40.1 NOREF#41.1 NOREF#51.1 NOREF#59.1 NOREF#61.1 NOREF#62.1 NOREF#64.1 NOREF#68.1 NOREF#72.9 NOREF#73.1 NOREF#74.1 NOREF#76.1 NOREF#78.1 NOREF#79.TP5 R1.1 R2.1 R15.1 R18.1 R28.1 R29.1 R33.2 R35.2 R39.1 R41.1 R45.1 R48.1 R51.1 R56.1 R58.1 R61.1 R63.1 R75.1 R77.1 R78.1 R79.1 R80.1 R83.2 SW1.3 SW1.4 SW2.3 SW2.4 U3.6 U3.8 U6.15 U8.6 U8.8 U32.8 U32.13 U33.2 U33.4 U35.1 U35.3 U37.2 USB1.1 USB1.12 USB1.13 USB1.14
PA0_ADC: NOREF#25.1 NOREF#60.1 R62.2 U6.6
PA4_SPI1_NSS_HC595_12_RCK: NOREF#38.15 R4.1 U6.10 U32.12
PA5_SPI1_SCK_HC595_11_SCK: NOREF#43.16 R25.1 U6.11 U32.11
PA7_SPI1_MOSI_HC595_14_SER: NOREF#70.1 R14.1 U6.13 U32.14
$1N3166: R3.1 R7.1 R8.2 R9.2 R10.1 R69.2
$1N5427: Q5.2 R7.2
$1N5751: D2.1 Q4.1 Q5.1 R11.1
$1N5765: D3.2 Q2.1 Q3.1 R12.2
$1N32014: LCD1.16 NOREF#5.2 R33.1
$1N33242: LCD1.11 NOREF#45.7 U32.2
$1N33289: LCD1.12 NOREF#9.6 U32.3
$1N33336: LCD1.13 NOREF#49.5 U32.4
$1N33383: LCD1.14 NOREF#75.4 U32.5
$1N33961: LCD1.6 NOREF#18.8 U32.1
$1N34010: LCD1.4 NOREF#52.10 U32.15
$1N34377: LCD1.3 NOREF#57.11 R34.2
$1N151939: Q3.2 R8.1
$1N256828: C49.1 H7.1 NOREF#46.1 U36.6 U38.2

Pads without a net: NOREF#12 1; NOREF#15 1; NOREF#16 1; NOREF#17 1; NOREF#23 1; NOREF#24 1; NOREF#28 1; NOREF#32 1; NOREF#35 1; NOREF#39 1; NOREF#42 1; NOREF#44 1; NOREF#47 1; NOREF#48 1; NOREF#50 1; NOREF#53 1; NOREF#54 14; NOREF#55 1; NOREF#56 1; NOREF#58 1; NOREF#63 1; NOREF#65 1; NOREF#66 1; NOREF#67 1; NOREF#71 1; NOREF#77 1; U32 6 7 9; U36 4; USB1 3 5 6 7 8 9

## Via types
v1: diameter 0.61, hole 0.305, Top Layer to Bottom Layer, 113 vias
v2: diameter 1, hole 0.5, Top Layer to Bottom Layer, 2 vias
v3: diameter 3, hole 2, Top Layer to Bottom Layer, 1 via
v4: diameter 1, hole 0.6, Top Layer to Bottom Layer, 1 via

## Routing (per net, layer and track width the routed paths; a pad name or vN(x,y) marks a point on that pad's centre or on a via; arc(x,y) is an arc through that point)
+3.3V: length 50.1
  Top Layer w0.254: C24.2 R55.2 70.55,83.53 ; v1(73.75,79.08) 73.75,82.39 72.61,83.53 70.55,83.53 ; 70.55,83.53 62.95,83.53 v1(62.57,83.15) ; C43.2 v1(51.15,76.09) U6.16
  Top Layer w0.5: C40.2 55.27,87.64 ; 55.27,87.64 C41.2 55.33,85.56 ; 55.27,87.64 LDO1.2 ; v1(51.14,83.27) 51.27,83.66 51.78,84.54 55.33,85.56 ; v1(51.02,81.11) 50.13,80.23 49.75,79.34 49.75,78.58 v1(50.13,78.19) ; 55.33,85.56 58.13,84.67 58.89,84.54 v1(59.65,84.04)
  Bottom Layer w0.254: L1.2 72.1,77.43 v1(73.75,79.08) ; v1(62.57,83.15) v1(59.65,84.04)
  Bottom Layer w0.5: v1(51.14,83.27) v1(51.02,81.11) ; v1(50.13,78.19) v1(51.15,76.09)
+5V: length 88.6
  Top Layer w0.5: D7.2 C18.2 U2.4 81.62,57.87 80.61,63.21 v1(80.1,66.76) ; 86.19,93.31 88.1,93.18 89.24,93.18 89.56,92.86 C23.2 91.4,88.96 ; v1(78.45,67.78) U3.16
  Top Layer w1: D9.2 C35.1 v1(71.34,65.75) ; 86.19,93.31 82.13,92.67 77.56,90.64 75.78,88.48 v2(75.4,77.94) ; v1(71.34,65.75) 70.57,70.95 70.57,73.5 v2(72.86,75.78) ; v1(71.34,65.75) 73.37,66.26 74.76,67.02 75.05,67.61 ; U3.16 75.05,67.61 ; 75.05,67.61 C21.2
  Bottom Layer w0.5: v1(80.1,66.76) v1(78.45,67.78)
  Bottom Layer w1: v2(72.86,75.78) v2(75.4,77.94)
+5V-D: length 190.2
  Top Layer w0.254: U32.16 67.4,87.47 v1(67.78,87.85) ; 59.78,87.72 60.29,88.73 v1(66.13,88.86)
  Top Layer w0.5: 20.92,91.4 23.08,91.28 24.35,90.13 24.73,89.24 24.35,88.23 22.31,85.43 v1(22.31,81.37) ; v1(34.38,57.24) 35.9,55.72 ; 35.9,55.72 C8.2 ; 35.9,55.72 U1.4 ; v1(49.24,90.64) 49.37,90.26 50.38,87.85 50.51,86.07 50.63,85.18 50.13,84.04 49.87,81.82 ; 52.89,93.78 55.72,95.72 NOREF#20.3 57.62,98.26 58.38,98.39 NOREF#6.TP1 NOREF#33.TP2 NOREF#69.TP3 NOREF#13.TP4 NOREF#2.TP5 87.47,98.51 NOREF.12 R67.1 ; 52.89,93.78 55.84,91.02 59.53,89.5 59.78,88.35 U32.10 ; 52.89,93.78 v1(50.89,92.42) ; 47.08,81.24 47.33,80.35 47.33,78.32 46.19,76.8 44.67,74.26 43.61,70.81 35.55,69.57 v1(35.4,69.69) 35.23,70.32 31.83,70.32 31.45,70.7 ; 47.08,81.24 49.87,81.82 ; 47.08,81.24 46.32,81.75 R74.2 ; 49.87,81.82 50.76,82 R14.2 R4.2 R25.2 ; U8.16 30.56,68.35 ; 30.56,68.35 C2.2 ; 30.56,68.35 R23.1 31.45,70.7 ; 31.45,70.7 D13.1 ; v1(34.38,59.27) 34.38,63.59 v1(36.16,66.51) ; R11.2 3.77,79.84
  Top Layer w1: C42.1 10.12,89.12 16.73,90.64 20.92,91.4 ; 22.31,77.94 22.31,74.13 23.46,72.61 D13.1
  Bottom Layer w0.254: v1(67.78,87.85) v1(66.13,88.86)
  Bottom Layer w0.5: v1(34.38,59.27) v1(34.38,57.24) ; C34.2 C42.1 ; v1(35.4,69.69) v1(36.16,66.51) ; v1(49.24,90.64) v1(50.89,92.42) ; v1(22.31,78.07) v1(22.31,81.37)
-5V: length 125.2
  Top Layer w0.5: 69.81,57.11 C19.1 U2.11 ; R66.2 98.64,86.96 98.64,78.83 98.01,72.99 C39.2 ; v1(84.16,77.05) 84.48,76.73 C20.2 U3.7 ; v1(83.4,78.58) 83.27,78.7 C22.2 83.27,80.83 U11.4
  Top Layer w1: 84.48,76.73 87.97,76.67 C39.2 98.51,56.73 D6.1 95.99,49.47 94.53,43.89 93.48,41.95 92.15,41.72 66.87,41.9 64.99,44.73 64.99,51.35 66.89,54.32 69.81,57.11 D8.1
  Bottom Layer w0.5: v1(84.16,77.05) v1(83.4,78.58)
-5V-D: length 180.4
  Top Layer w0.254: 37.54,70.97 v1(39.46,71.08) ; 37.54,70.97 35.78,71.08 34.89,71.08 34,71.21 33.62,71.46 33.36,72.48 33.24,73.5 32.73,74.64 32.09,74.77 30.44,74.89 28.92,74.64 27.78,74.26 26.25,74.26 25.23,74.64 R76.2 ; 37.54,70.97 37.81,70.95 ; v1(25.49,88.48) 28.28,88.23 30.95,88.23 32.1,88.51 35.97,93.15 39.69,94.1 41.47,95.63 41.62,97.75 42,98.39 ; v1(40.73,68.92) 42.38,68.8 43.9,68.92 48.22,68.67 49.11,65.24 49.11,58.51 C9.1 ; 26.63,59.83 27.14,61.68 27.39,64.35 27.52,70.83 27.27,70.95 24.6,71.08 22.19,71.34 20.79,72.99 20.66,76.03 20.79,78.07 19.52,78.7 18.63,79.84
  Top Layer w0.3: U8.7 26.05,60.41
  Top Layer w0.5: 42,98.39 42.63,99.02 55.72,99.28 87.72,99.28 91.28,98.9 93.43,98.51 93.94,94.58 R66.1 ; v1(23.46,89.12) 19.65,85.31 C38.2 ; R24.1 26.63,57.37 26.63,59.83 26.05,60.41 ; R76.2 24.98,78.07 U34.4 22.87,78.86 21.85,79.18 C47.1 19.39,80.1 ; U1.11 C9.1 ; C1.2 U8.7 ; R12.1 13.55,79.84
  Bottom Layer w0.254: v1(25.49,88.48) v1(23.46,89.12) ; v1(39.46,71.08) v1(40.73,68.92)
  Bottom Layer w0.5: C37.1 C38.2
GND: length 59.1
  Top Layer w0.254: U32.13 v1(63.59,87.97) ; v1(55.33,76.8) 55.28,76.74 U6.15
  Top Layer w0.5: U33.2 v1(45.56,78.89) ; NOREF#59.1 28.92,93.18 U35.1 R80.1 ; NOREF#59.1 C13.1 ; NOREF#59.1 31.46,93.81 U35.3 ; v1(52.41,85.94) v1(51.91,86.45) v1(51.59,87.48) ; 56.24,92.2 v1(57.59,92.09) U32.8 ; 6.4,97.27 USB1.13 ; USB1.12 USB1.14
  Top Layer w1: C42.2 15.33,85.31 ; SW2.4 SW2.3 SW1.4 SW1.3
  Top Layer w2: L3.1 C12.2 ; NOREF#29.1 10.5,44.03 10.25,44.28 LC1.1
  Bottom Layer w0.5: C34.1 C42.2 ; C37.2 C38.1 ; C48.1 C12.2
  vias: v1(11.89,95.34) v1(11.89,93.31) v1(16.03,92.93) v1(22.38,60.29) v1(25.05,61.68) v1(25.05,59.14) v1(32.61,53.3) v1(32.72,55.84) v1(33.1,76.67) v1(33.68,69.05) v1(38.71,83.27) v1(41.12,87.72) v1(41.86,91.97) v1(43.43,81.62) v1(49.43,55.72) v1(49.68,76.16) v1(50.39,96.61) v1(55.1,60.41) v1(55.1,57.36) v1(55.2,63.45) v1(55.23,54.31) v1(55.28,51.52) v1(55.84,77.43) v1(55.97,76.42) v1(56.1,75.53) v1(56.1,74.51) v1(56.48,72.99) v1(56.67,88.61) v1(56.67,86.83) v1(58.52,72.1) v1(63.15,72.99) v1(64.16,75.4) v1(65.24,77.18) v1(66.32,72.99) v1(68.68,49.24) v1(70.62,89.3) v1(72.11,61.05) v1(72.31,89.34) v1(72.48,71.34) v1(72.86,58.83) v1(73.25,93.81) v1(73.2,92.04) v1(73.68,68.29) v1(82.44,76.56) v1(82.44,74.02) v1(84.74,79.34) v1(85.88,75.27) v1(87.21,55.46) v1(88.06,91.15) v1(89.49,72.24) v1(89.53,68.69) v1(90.88,49.11) v1(92.41,63.08) v1(92.67,61.55) v1(95.37,81.08) v1(96.98,81.22) v3(4.66,58) v4(56.22,92.8)
(no net): length 7.4
  Top Layer w0.254: U32.7 59.78,93.05 59.27,93.56 58.76,93.56 NOREF#24.1 ; NOREF#54.14 61.05,93.05 U32.6
PA0_ADC: length 11.4
  Top Layer w0.254: U6.6 61.5,76.74 65.49,80.73 NOREF#60.1
  Top Layer w0.5: R62.2 NOREF#25.1
PA1_4053_11_SA_10X: length 24.6
  Top Layer w0.254: U3.11 77.13,74.13 75.91,74.13 71.97,78.07 71.97,80.61 70.57,82 65.75,82 61.13,77.39 59.35,77.39
PA2_4053_10_SB_10X: length 24.2
  Top Layer w0.254: U3.10 75.64,75.29 72.48,78.45 72.48,80.99 70.96,82.51 65.37,82.51 60.9,78.04 U6.8
PA3_4053_9_SC_10X: length 23.9
  Top Layer w0.254: U6.9 60.66,78.69 64.99,83.02 71.46,83.02 72.99,81.5 72.99,78.83 75.26,76.56 U3.9
PA4_SPI1_NSS_HC595_12_RCK: length 14.6
  Top Layer w0.254: 60.34,81.3 61.44,82.4 v1(61.56,82.4) 61.68,82.53 61.68,84.92 62.32,85.56 U32.12 ; 60.34,81.3 59.35,80.3 U6.10 ; 60.34,81.3 60.92,80.86 ; R4.1 v1(58.89,83.53)
  Bottom Layer w0.254: v1(58.89,83.53) v1(61.56,82.4)
PA5_SPI1_SCK_HC595_11_SCK: length 15.6
  Top Layer w0.254: U32.11 61.05,83.27 v1(59.63,81.86) NOREF#43.16 57.11,79.34 53.61,79.34 U6.11 ; R25.1 v1(57.62,82.13)
  Bottom Layer w0.254: v1(57.62,82.13) v1(59.63,81.86)
PA7_SPI1_MOSI_HC595_14_SER: length 22.5
  Top Layer w0.254: U6.13 52.19,78.04 51.4,78.83 51.4,79.84 51.65,80.1 52.71,80.1 ; 52.71,80.1 R14.1 ; 52.71,80.1 56.73,80.1 60.41,83.78 v1(60.41,84.54) ; v1(62.45,84.42) 62.83,84.8 64.35,84.8 64.86,85.31 U32.14
  Bottom Layer w0.254: v1(62.45,84.42) 60.54,84.42 v1(60.41,84.54)
PA10_TIM1_SPWM: length 5.1
  Top Layer w0.254: U6.18 50.15,74.79 49.49,74.13 49.49,73.99 R22.2
PB1_4053_DANG_WEI: length 35.7
  Top Layer w0.254: v1(34.12,65.88) 31.33,61.18 30.25,61.09 ; 53.61,77.39 51.78,77.43 48.73,77.56 47.97,77.05 46.82,73.75 46.32,71.34 45.35,70.18 40.09,69.56 38.57,69.18 36.89,68.98 35.65,68.67 v1(34.3,67.7)
  Top Layer w0.5: U8.9 U8.10 U8.11
  Bottom Layer w0.254: v1(34.3,67.7) v1(34.12,65.88)
$1N2503: length 15.5
  Top Layer w0.3: Q6.2 14,64.54 14.95,65.49 17.75,65.49 R5.1
  Top Layer w0.5: R71.2 11.47,64.05
  Top Layer w0.7: Q6.2 11.47,64.05 10.24,62.81 R69.1
$1N3166: length 35.3
  Top Layer w0.3: R69.2 R3.1
  Top Layer w0.5: R9.2 17.1,73.51 R8.2 ; R10.1 7.11,73.69 R7.1
  Top Layer w1: 7.07,70.34 R69.2 ; 7.07,70.34 16.47,71.97 17.1,73.51 ; 7.07,70.34 7.11,73.69
$1N4522: length 40.3
  Top Layer w0.254: R71.1 5.29,60.17 3.64,61.81 3.64,63.33 5.42,65.11 12.66,65.11 14.44,66.89 17.62,66.89 R6.1
  Top Layer w0.5: R71.1 11.36,59.22 ; 11.36,59.22 D12.2 C10.1 ; 11.36,59.22 Q7.2
$1N4539: length 5.3
  Top Layer w0.3: U8.1 R6.2
$1N5427: length 1.7
  Top Layer w0.5: R7.2 Q5.2
$1N5596: length 1.7
  Top Layer w0.5: R9.1 Q2.2
$1N5676: length 1.8
  Top Layer w0.5: R10.2 Q4.2
$1N5751: length 8.5
  Top Layer w0.5: 2.25,76.83 Q4.1 4.41,78.19 6.44,78.19 Q5.1 ; 2.25,76.83 D2.1 ; 2.25,76.83 R11.1
$1N5765: length 8.8
  Top Layer w0.5: D3.2 R12.2 Q2.1 13.23,77.1 14.05,77.94 16,77.94 16.59,76.9 Q3.1
$1N6068: length 64.2
  Top Layer w0.5: D2.2 D3.1
  Top Layer w1: U1.7 26.89,44.92 3.26,47.59 2.5,47.97 1.87,48.98 D2.2
$1N6551: length 25.4
  Top Layer w0.5: R17.2 40.35,45.31 40.35,48.6 38.32,50.64 U1.6 39.71,51.27 v1(40.6,52.92) ; R13.1 v1(39.97,54.95)
  Bottom Layer w0.5: v1(39.97,54.95) v1(40.6,52.92)
$1N6884: length 19.6
  Top Layer w0.3: U1.5 37.05,53.3 R15.2
  Top Layer w0.5: U1.5 39.46,53.17 41.36,55.08 41.36,65.36 R16.1
$1N6914: length 5.9
  Top Layer w0.5: R16.2 44.79,65.23 U1.14 U1.13
$1N7022: length 5.8
  Top Layer w0.5: R13.2 37.94,64.11 U1.1 U1.2
$1N7167: length 6.6
  Top Layer w0.5: U1.9 U1.8 44.79,47.98 R17.1
$1N7251: length 9.1
  Top Layer w0.5: R18.2 C3.1 U1.10
$1N8310: length 3.6
  Top Layer w0.5: C7.2 51.99,54.31 ; 51.99,54.31 R19.1 ; 51.99,54.31 C3.2
$1N8402: length 3.3
  Top Layer w0.5: C6.2 51.99,57.37 ; 51.99,57.37 R19.2 ; 51.99,57.37 R20.1
$1N8494: length 3.4
  Top Layer w0.5: 51.96,60.46 R20.2 ; 51.96,60.46 51.94,61.27 ; 51.96,60.46 C5.2
$1N8586: length 11.6
  Top Layer w0.254: 51.96,63.6 49.11,71.08 R22.1
  Top Layer w0.5: R21.2 51.96,63.6 C4.2
$1N12567: length 4.2
  Top Layer w0.5: Q6.3 Q7.3
$1N13727: length 8.2
  Top Layer w0.3: v1(29.17,64.22) U8.13
  Top Layer w0.5: v1(28.41,62.7) 28.41,57.63 R24.2
  Bottom Layer w0.3: v1(28.41,62.7) v1(29.17,64.22)
$1N14310: length 19.2
  Top Layer w0.3: v1(29.17,65.49) U8.14
  Top Layer w0.5: Q6.1 15.9,62.94 ; 15.9,62.94 Q7.1 ; 15.9,62.94 20.78,62.94 22.19,64.35 v1(23.08,64.35)
  Bottom Layer w0.3: v1(29.17,65.49) v1(23.08,64.35)
$1N14625: length 29.7
  Top Layer w0.5: U8.15 34.89,66.76 36.16,68.03 46.19,68.03 47.71,66.51 47.71,58.64 47.21,58.13 44.92,58.13 U1.12
$1N14690: length 26.5
  Top Layer w0.5: U1.3 35.14,58.25 32.22,58 29.93,56.22 28.16,55.59 25.87,55.59 23.2,56.22 21.04,58.51 20.16,59.91 20.66,61.18 21.04,61.68 22.19,62.06 24.22,64.1 U8.4
$1N15443: length 10.7
  Top Layer w0.3: U8.2 R5.2 U8.3
$1N15545: length 14.7
  Top Layer w0.3: U8.5 26.05,62.95 26.63,63.54 26.63,69.43 26,70.07 R3.2
$1N15824: length 8.6
  Top Layer w0.3: R23.2 28.28,69.04 28.28,63.92 29.25,62.95 U8.12
$1N18428: length 5.3
  Top Layer w2: C10.2 C11.2
$1N18573: length 4.9
  Top Layer w2: HC1.1 C11.1
  Bottom Layer w1: C11.1 21.42,50.25
$1N19610: length 4.2
  Bottom Layer w0.254: 88.23,45.05 88.1,44.92
  Bottom Layer w0.5: C45.2 91.28,44.54 HP1.1
$1N19696: length 3.8
  Bottom Layer w0.5: C44.2 71.59,45.05 LP1.1
$1N21004: length 10.9
  Top Layer w0.5: C45.1 R29.2 R30.1
$1N21176: length 11.4
  Top Layer w0.5: R31.1 72.09,49.24 R28.2 C44.1
$1N32014: length 1.9
  Top Layer w0.5: NOREF#5.2 52.15,96.86 R33.1
$1N33242: length 5
  Top Layer w0.254: 66.13,92.01 66.13,96.61 NOREF#45.7
$1N33289: length 5.3
  Top Layer w0.254: NOREF#9.6 64.86,95.85 U32.3
$1N33336: length 5.8
  Top Layer w0.254: U32.4 63.59,93.56 61.68,95.47 61.68,96.48 NOREF#49.5
$1N33383: length 6.4
  Top Layer w0.254: U32.5 62.32,93.43 58.89,96.86 NOREF#75.4
$1N33961: length 15.9
  Top Layer w0.5: NOREF#18.8 78.7,97.24 69.43,97.24 67.4,95.21 U32.1
$1N34010: length 25.2
  Top Layer w0.5: NOREF#52.10 82.51,95.21 69.94,95.21 69.43,94.7 69.43,90.77 66.13,87.47 66.13,86.47
$1N34377: length 9.5
  Top Layer w0.5: NOREF#57.11 86.07,95.21 83.4,94.32 R34.2
$1N38466: length 3.4
  Top Layer w0.254: U6.4 C14.1
$1N38585: length 1.5
  Top Layer w0.254: R35.1 U6.1
$1N39082: length 7.5
  Top Layer w0.254: U6.2 60.18,74.14 arc(60.86,74.01) 61.43,73.62 61.52,73.53 arc(61.69,73.28) C15.1
  Top Layer w0.5: X1.1 63.81,69.98 61.75,72.04 C15.1
$1N39137: length 11.9
  Top Layer w0.254: 64.92,72.99 64,73.91 arc(63.75,74.07) 63.46,74.13 62.06,74.13 arc(61.33,74.62) 60.47,74.79 U6.3
  Top Layer w0.5: X1.2 67.91,69.3 64.92,72.29 64.92,72.99
$1N41107: length 9.9
  Top Layer w0.254: U6.5 61.74,76.09 62.06,76.42 C17.2
  Top Layer w0.5: L1.1 66.51,78.7 65.75,78.7 64.48,78.45 63.97,77.94 C17.2
$1N43119: length 5.7
  Top Layer w0.5: R42.1 U2.2 U2.1
$1N43180: length 5.3
  Top Layer w0.5: U2.14 U2.13 R40.2
$1N44869: length 12.5
  Top Layer w0.5: 86.45,67.17 84.8,67.17 U3.1 U2.7 R36.1 R38.2 C30.2
$1N45226: length 7.3
  Top Layer w0.5: U2.6 R36.2 R38.1 C30.1 R39.2
$1N46458: length 14
  Top Layer w0.5: R37.1 U2.9 79.34,62.19 R42.2
$1N46863: length 10.6
  Top Layer w0.5: R40.1 78.32,59.53 U2.10 R41.2
$1N47509: length 21.4
  Top Layer w0.5: 94,51.13 D6.2 ; 94,51.13 R30.2 85.69,54.7 U2.3 ; 94,51.13 D7.1
$1N53554: length 15.3
  Top Layer w0.254: U2.8 78.39,66.23 79.2,67.34 80.73,70.07 U3.3
  Top Layer w0.5: U3.3 84.93,70.73 86.45,70.73 ; R37.2 U2.8
$1N53555: length 5.6
  Top Layer w0.5: R48.2 R47.1 R46.1 U3.5
$1N53825: length 32.7
  Top Layer w0.254: U11.7 89.24,85.43 88.23,83.91 85.31,82.64 82.26,82.51 82,82.39 81.24,81.37 80.35,77.31 79.72,72.22 79.21,71.84 78.7,71.72 U3.13
  Top Layer w0.5: U11.7 R60.1 R59.2 C29.2 ; R49.2 R50.2 U3.13
$1N53826: length 4.8
  Top Layer w0.5: U3.12 R50.1 R49.1 R51.2
$1N54675: length 5.6
  Top Layer w0.5: R45.2 R44.1 R43.1 U3.2
$1N57431: length 7.5
  Top Layer w0.5: U11.2 R53.2 R52.1 C28.1 R54.1
$1N60276: length 9
  Top Layer w0.5: C28.2 R52.2 R53.1 83.78,88.96 85.56,90 R62.1
$1N63379: length 16.9
  Top Layer w0.254: 70.81,86.14 R56.2 C25.2 72.28,86.31 ; 70.81,86.14 70.62,86.12 ; 70.81,86.14 72.28,86.31 ; 72.28,86.31 C24.1 73.75,86.07 74.13,85.69 74.13,83.78 v1(74.26,83.66) ; 77.7,83.53 R54.2
  Top Layer w0.5: R57.2 79.25,83.53 v1(77.05,83.53)
  Bottom Layer w0.254: v1(74.26,83.66) 76.92,83.66 v1(77.05,83.53)
$1N64752: length 6.2
  Top Layer w0.5: C26.2 80.06,81.94 81.35,83.23 R57.1 83.52,84.13 83.78,83.88
$1N65001: length 4.9
  Top Layer w0.5: C27.2 U11.5 93.56,81.34 R58.2
$1N65468: length 7.4
  Top Layer w0.5: 91.4,83.88 R60.2 R59.1 C29.1 96.98,82.72
$1N66675: length 11.7
  Top Layer w0.254: U3.14 78.34,70.21 v1(79.08,70.95) ; C26.1 v1(78.96,72.61)
  Bottom Layer w0.254: v1(78.96,72.61) v1(79.08,70.95)
$1N66770: length 18.5
  Top Layer w0.254: C27.1 84.54,77.94 83.15,77.56 81.75,77.56 80.99,77.05 80.86,75.4 80.48,71.46 78.96,69.3 U3.15
$1N80254: length 8.3
  Top Layer w0.254: U6.19 52.17,74.14 51.27,73.24 51.27,70.07 52.16,69.18 52.92,69.18 H5.2
$1N80871: length 38.1
  Top Layer w0.254: SW2.1 54.57,47.35 54.57,48.86 56.48,50.76 56.48,63.97 55.08,65.37 55.08,75.15 54.78,75.44 U6.17
  Top Layer w1: SW2.2 SW2.1
$1N81993: length 42.4
  Top Layer w0.254: U6.12 56.23,78.69 57.49,77.43 57.49,50.51 59.65,48.35 59.65,46.79
  Top Layer w1: SW1.1 SW1.2
$1N91644: length 17.6
  Top Layer w0.254: U3.4 v1(83.78,71.46) ; C31.1 90.26,70.45 v1(87.85,71.08)
  Bottom Layer w0.254: v1(83.78,71.46) v1(87.85,71.08)
$1N91645: length 11.4
  Top Layer w0.5: U2.5 R63.2 C31.2
$1N151939: length 1.8
  Top Layer w0.5: R8.1 Q3.2
$1N174858: length 11.1
  Top Layer w0.5: D9.1 D8.2 R31.2 74,54.57 U2.12
$1N181368: length 4.1
  Top Layer w0.5: R34.1 R1.2 R2.2
$1N184453: length 2.2
  Top Layer w0.254: H5.1 53.61,71.89 U6.20
$1N216247: length 11.9
  Top Layer w0.5: D13.2 L2.2 43.14,74 U33.1
$1N219597: length 11.4
  Top Layer w0.5: U33.7 36.79,79.08 R72.1 34.76,77.69 34.63,76.29 34.89,75.53 R73.2 L2.1
$1N220800: length 2.3
  Top Layer w0.5: U33.8 R73.1
$1N221940: length 2.1
  Top Layer w0.5: 43.43,80.35 C46.1
$1N223416: length 5
  Top Layer w0.5: R74.1 R75.2 39.97,81.75 U33.5
$1N224380: length 10.3
  Top Layer w0.5: U34.1 U34.8 32.09,82.51 R26.1 32.22,81.24 U34.7
$1N225642: length 8.4
  Top Layer w0.5: L3.2 D1.1 24.09,84.29 23.71,83.15 23.58,82.13 23.84,81.75 24.47,81.37 U34.2
$1N226684: length 2.6
  Top Layer w0.5: C47.2 U34.3
$1N230914: length 7.4
  Top Layer w0.5: 30.34,76.51 U34.5 ; 30.34,76.51 R77.2 ; 30.34,76.51 R76.1
$1N242916: length 61.5
  Top Layer w0.254: LED1.1 18.25,99.53 20.28,99.53 20.92,98.9 LED2.1
  Top Layer w0.5: 24.33,92.94 24.6,92.67 24.6,91.78 27.27,89.12 31.2,89.12 31.2,89.62 32.73,91.15 U35.4 ; 24.33,92.94 25.76,92.94 26.89,94.07 26.89,95.28 U35.8 ; 24.33,92.94 24.09,93.18 19.14,93.18 15.96,96.35 14.65,96.35 14.62,96.39 14.62,96.66 ; 14.62,96.66 14.35,93.71 ; 14.62,96.66 14.63,96.95 ; USB1.11 14.19,91.91 14.35,93.71 ; USB1.2 12.28,96.74 14.63,96.95 ; LED1.1 15.43,97.75 14.63,96.95 ; 14.35,93.71 C50.2
$1N243941: length 4
  Top Layer w0.254: USB1.4 R78.2
$1N244092: length 4.1
  Top Layer w0.254: R79.2 7.33,92.42 6.95,92.29 USB1.10
$1N245387: length 1.6
  Top Layer w0.5: U35.2 R80.2
$1N247017: length 5.3
  Top Layer w0.254: R81.2 20.79,94.58 19.01,96.35 LED1.2
$1N247239: length 2.1
  Top Layer w0.254: LED2.2 R82.2
$1N247546: length 9.2
  Top Layer w0.254: U35.7 30.19,98.13 29.68,98.64 28.66,98.64 24.6,94.58 R81.1
$1N247702: length 6.4
  Top Layer w0.254: U35.6 31.33,97.44 31.33,98.51 30.57,99.28 28.41,99.28 27.9,98.77 R82.1
$1N255065: length 6.5
  Top Layer w0.254: U38.3 44.03,91.78 43.14,91.02 U37.3
$1N255538: length 3.5
  Top Layer w0.254: U38.1 45.43,89.24 46.57,88.86 46.7,88.35 U36.1
$1N255699: length 3.8
  Top Layer w0.254: U37.1 U36.3
$1N256086: length 4.3
  Top Layer w0.254: U36.2 45.81,87.08 45.43,86.7 44.41,86.7 43.9,86.83 R83.1
$1N256828: length 10
  Top Layer w0.254: 47.71,85.47 H7.1 ; 47.71,85.47 U36.6 ; 47.71,85.47 48.48,84.04 C49.1
  Top Layer w0.5: H7.1 48.73,87.97 U38.2
$1N257154: length 6.4
  Top Layer w0.254: 47.14,83.02 45.81,83.91 U36.5 45.81,85.69 45.56,86.07 44.41,86.07 R84.2
$1N261246: length 23.3
  Top Layer w0.254: v1(38.82,89.12) 39.59,87.59 40.09,85.81 R84.1 ; v1(36.54,90) 36.41,91.15 v1(36.66,92.55)
  Top Layer w0.5: v1(36.09,94.7) 37.02,97.43 ; 37.02,97.43 SW3.1 ; 37.02,97.43 H6.1 U35.5
  Bottom Layer w0.254: v1(38.82,89.12) v1(36.54,90)
  Bottom Layer w0.5: v1(36.09,94.7) v1(36.66,92.55)
$1N261413: length 41.3
  Top Layer w0.5: 38.02,80.35 R72.2 34.53,80.15 R26.2 U34.6
  Top Layer w1: LDO1.3 51.27,90.77 48.98,92.42 SW3.3 SW3.2 42.76,93.69 41.24,93.18 38.19,92.42 37.81,90.39 C12.1 35.01,82.64 34.53,80.15
  Bottom Layer w0.5: C48.2 C12.1

## Copper pours and planes (outline as drawn; the poured copper is in the pictures)
+5V-D on Top Layer: 2.09,87.21 9.74,87.21 9.74,78.85 2.09,78.85
-5V-D on Top Layer: 12.41,87.25 20.4,87.25 20.4,78.7 12.41,78.7
GND on Top Layer: 54.95,78.19 56.99,78.19 56.99,73.24 54.95,73.24
GND on Top Layer: -0.02,40.62 100.02,40.62 100.02,-0.06 -0.02,-0.06
GND on Bottom Layer: 0,99.49 100.02,99.49 100.02,-0.57 0,-0.57

## Text on the board
Bottom Silkscreen Layer: BT+ | BT- | yjmwxwx-2023-03-30 | LC | HC | LP | HP | 按键2 | 按键1 | ADC飞线 | 电池内阻测试仪 | 电池+ | 电池 -飞线 | 莱州大尹家村尹辑明设计
Top Silkscreen Layer: GND | CLK | DIO | ADC | BT- | LC | HC | LP | HP | SWD
